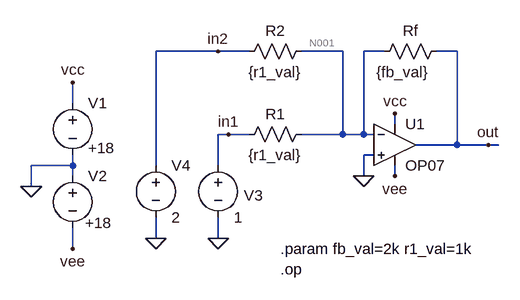
[diagram p0: schematic 09-adder.asc]
09-adder.asc, the LTspice schematic file:
Version 4
SHEET 1 880 680
WIRE 16 -64 -80 -64
WIRE 64 -64 16 -64
WIRE 208 -64 144 -64
WIRE 272 -64 240 -64
WIRE 384 -64 352 -64
WIRE -208 16 -208 -16
WIRE 288 48 288 32
WIRE 32 64 16 64
WIRE 64 64 32 64
WIRE 208 64 208 -64
WIRE 208 64 144 64
WIRE 240 64 240 -64
WIRE 240 64 208 64
WIRE 256 64 240 64
WIRE 384 80 384 -64
WIRE 384 80 320 80
WIRE 432 80 384 80
WIRE 448 80 432 80
WIRE 256 96 240 96
WIRE -208 112 -208 96
WIRE -208 112 -272 112
WIRE -80 112 -80 -64
WIRE 16 112 16 64
WIRE -208 128 -208 112
WIRE 240 128 240 96
WIRE 288 128 288 112
WIRE -272 144 -272 112
WIRE -80 224 -80 192
WIRE 16 224 16 192
WIRE -208 240 -208 208
FLAG -272 144 0
FLAG -208 -16 vcc
FLAG -208 240 vee
FLAG 16 224 0
FLAG 32 64 in1
FLAG 288 128 vee
FLAG 288 32 vcc
FLAG 432 80 out
FLAG 240 128 0
FLAG -80 224 0
FLAG 16 -64 in2
DATAFLAG 208 -32 ""
DATAFLAG 384 -32 ""
SYMBOL OpAmps\\OP07 288 16 R0
SYMATTR InstName U1
SYMBOL voltage -208 0 R0
WINDOW 3 24 85 Left 2
WINDOW 123 0 0 Left 0
WINDOW 39 0 0 Left 0
SYMATTR Value +18
SYMATTR InstName V1
SYMBOL voltage -208 112 R0
WINDOW 3 19 88 Left 2
WINDOW 123 0 0 Left 0
WINDOW 39 0 0 Left 0
SYMATTR Value +18
SYMATTR InstName V2
SYMBOL res 368 -80 R90
WINDOW 0 0 56 VBottom 2
WINDOW 3 32 68 VTop 2
SYMATTR InstName Rf
SYMATTR Value {fb_val}
SYMBOL res 160 48 R90
WINDOW 0 0 56 VBottom 2
WINDOW 3 32 56 VTop 2
SYMATTR InstName R1
SYMATTR Value {r1_val}
SYMBOL res 160 -80 R90
WINDOW 0 0 56 VBottom 2
WINDOW 3 32 56 VTop 2
SYMATTR InstName R2
SYMATTR Value {r1_val}
SYMBOL voltage 16 96 R0
WINDOW 0 40 62 Left 2
WINDOW 123 0 0 Left 0
WINDOW 39 0 0 Left 0
SYMATTR InstName V3
SYMATTR Value 1
SYMBOL voltage -80 96 R0
WINDOW 123 0 0 Left 0
WINDOW 39 0 0 Left 0
SYMATTR InstName V4
SYMATTR Value 2
TEXT 112 240 Left 2 !.param fb_val=2k r1_val=1k
TEXT 112 272 Left 2 !.op

The netlist it stands for:
* 09-adder.asc
XU1 0 N001 vcc vee out LT1001  ; OP07, pins In+ In- V+ V- OUT
V1 vcc 0 +18
V2 0 vee +18
Rf out N001 {fb_val}
R1 N001 in1 {r1_val}
R2 N001 in2 {r1_val}
V3 in1 0 1
V4 in2 0 2
.param fb_val=2k r1_val=1k
.op
.lib LTC.lib
.backanno
.end

* Results of the author's LTspice run, read from the files saved beside the schematic
* Operating Point:
*   V(n001) = 8.174 µV
*   V(vcc) = 18 V
*   V(vee) = -18 V
*   V(out) = -6 V
*   V(in1) = 1 V
*   V(in2) = 2 V
*   I(R2) = -2 mA
*   I(R1) = -1 mA
*   I(Rf) = -3 mA
*   I(V4) = -2 mA
*   I(V3) = -1 mA
*   I(V2) = -4 mA
*   I(V1) = -1 mA
*   Ix(u1:1) = -110.3 fA
*   Ix(u1:2) = 110.4 fA
*   Ix(u1:3) = 1 mA
*   Ix(u1:4) = -4 mA
*   Ix(u1:5) = 3 mA
* From the log:
*   Semiconductor Device Operating Points:
*                           --- Diodes ---
*   Name:    d:u1:4      d:u1:1
*   Model:    u1:di       u1:x
*   Id:      8.17e-15    1.00e-13
*   Vd:      8.17e-06    1.00e-01
*   Req:     1.00e-09    1.00e-12
*   CAP:     0.00e+00    0.00e+00
*                           --- VDMOSFET Transistors ---
*   Name:        m:u1:2      m:u1:1
*   Model:        u1:p        u1:n
*   Id:         -4.00e-03    1.00e-03
*   Vgs:        -1.00e-01   -1.00e-01
*   Vds:        -1.20e+01    2.40e+01
*   Vth:         3.00e-01   -3.00e-01
*   Gm:          2.00e-02    1.00e-02
*   Gds:         0.00e+00    0.00e+00
*   Cgs:         0.00e+00    0.00e+00
*   Cgd:         0.00e+00    0.00e+00
*   Cbody:       0.00e+00    0.00e+00